# Altium project Oski_Bear_PCB.PrjPcb
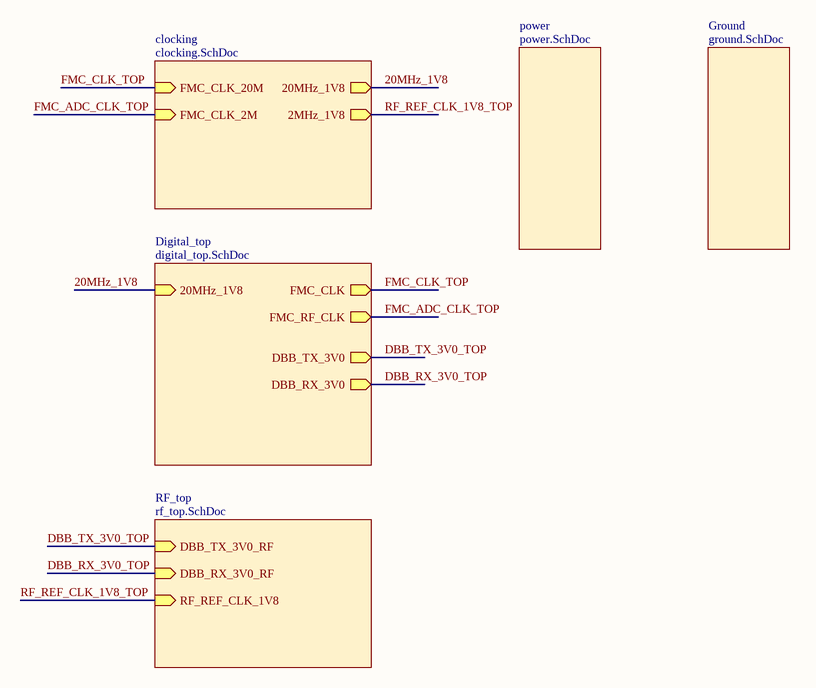
[diagram p0: Top.SchDoc]
6 sheets, 187 parts. Net scope: hierarchical (ports join the sheet entries above them; power ports are global).
Board file: Oski_PCB.PcbDoc
Sheets:
  Top.SchDoc
    Digital_top = digital_top.SchDoc
    power = power.SchDoc
    Ground = ground.SchDoc
    RF_top = rf_top.SchDoc
    clocking = clocking.SchDoc

## Sheet Top.SchDoc
size A; SheetNumber: 1; SheetTotal: 6

### Sub-sheets
clocking = clocking.SchDoc: 20MHz_1V8 (out), FMC_CLK_20M (in), FMC_CLK_2M (in), 2MHz_1V8 (out)
Digital_top = digital_top.SchDoc: 20MHz_1V8 (in), FMC_CLK (out), FMC_RF_CLK (out), DBB_RX_3V0 (out), DBB_TX_3V0 (out)
Ground = ground.SchDoc: no entries
power = power.SchDoc: no entries
RF_top = rf_top.SchDoc: DBB_TX_3V0_RF (in), DBB_RX_3V0_RF (in), RF_REF_CLK_1V8 (in)

### Nets
20MHz_1V8: sheet Digital_top/20MHz_1V8, sheet clocking/20MHz_1V8
DBB_RX_3V0_TOP: sheet Digital_top/DBB_RX_3V0, sheet RF_top/DBB_RX_3V0_RF  [project net DBB_RX_3V0]
DBB_TX_3V0_TOP: sheet Digital_top/DBB_TX_3V0, sheet RF_top/DBB_TX_3V0_RF  [project net DBB_TX_3V0]
FMC_ADC_CLK_TOP: sheet Digital_top/FMC_RF_CLK, sheet clocking/FMC_CLK_2M
FMC_CLK_TOP: sheet Digital_top/FMC_CLK, sheet clocking/FMC_CLK_20M
RF_REF_CLK_1V8_TOP: sheet RF_top/RF_REF_CLK_1V8, sheet clocking/2MHz_1V8  [project net RF_REF_CLK_1V8]

## Sheet digital_top.SchDoc
size 635 x 304 mm; SheetNumber: 4; SheetTotal: 6
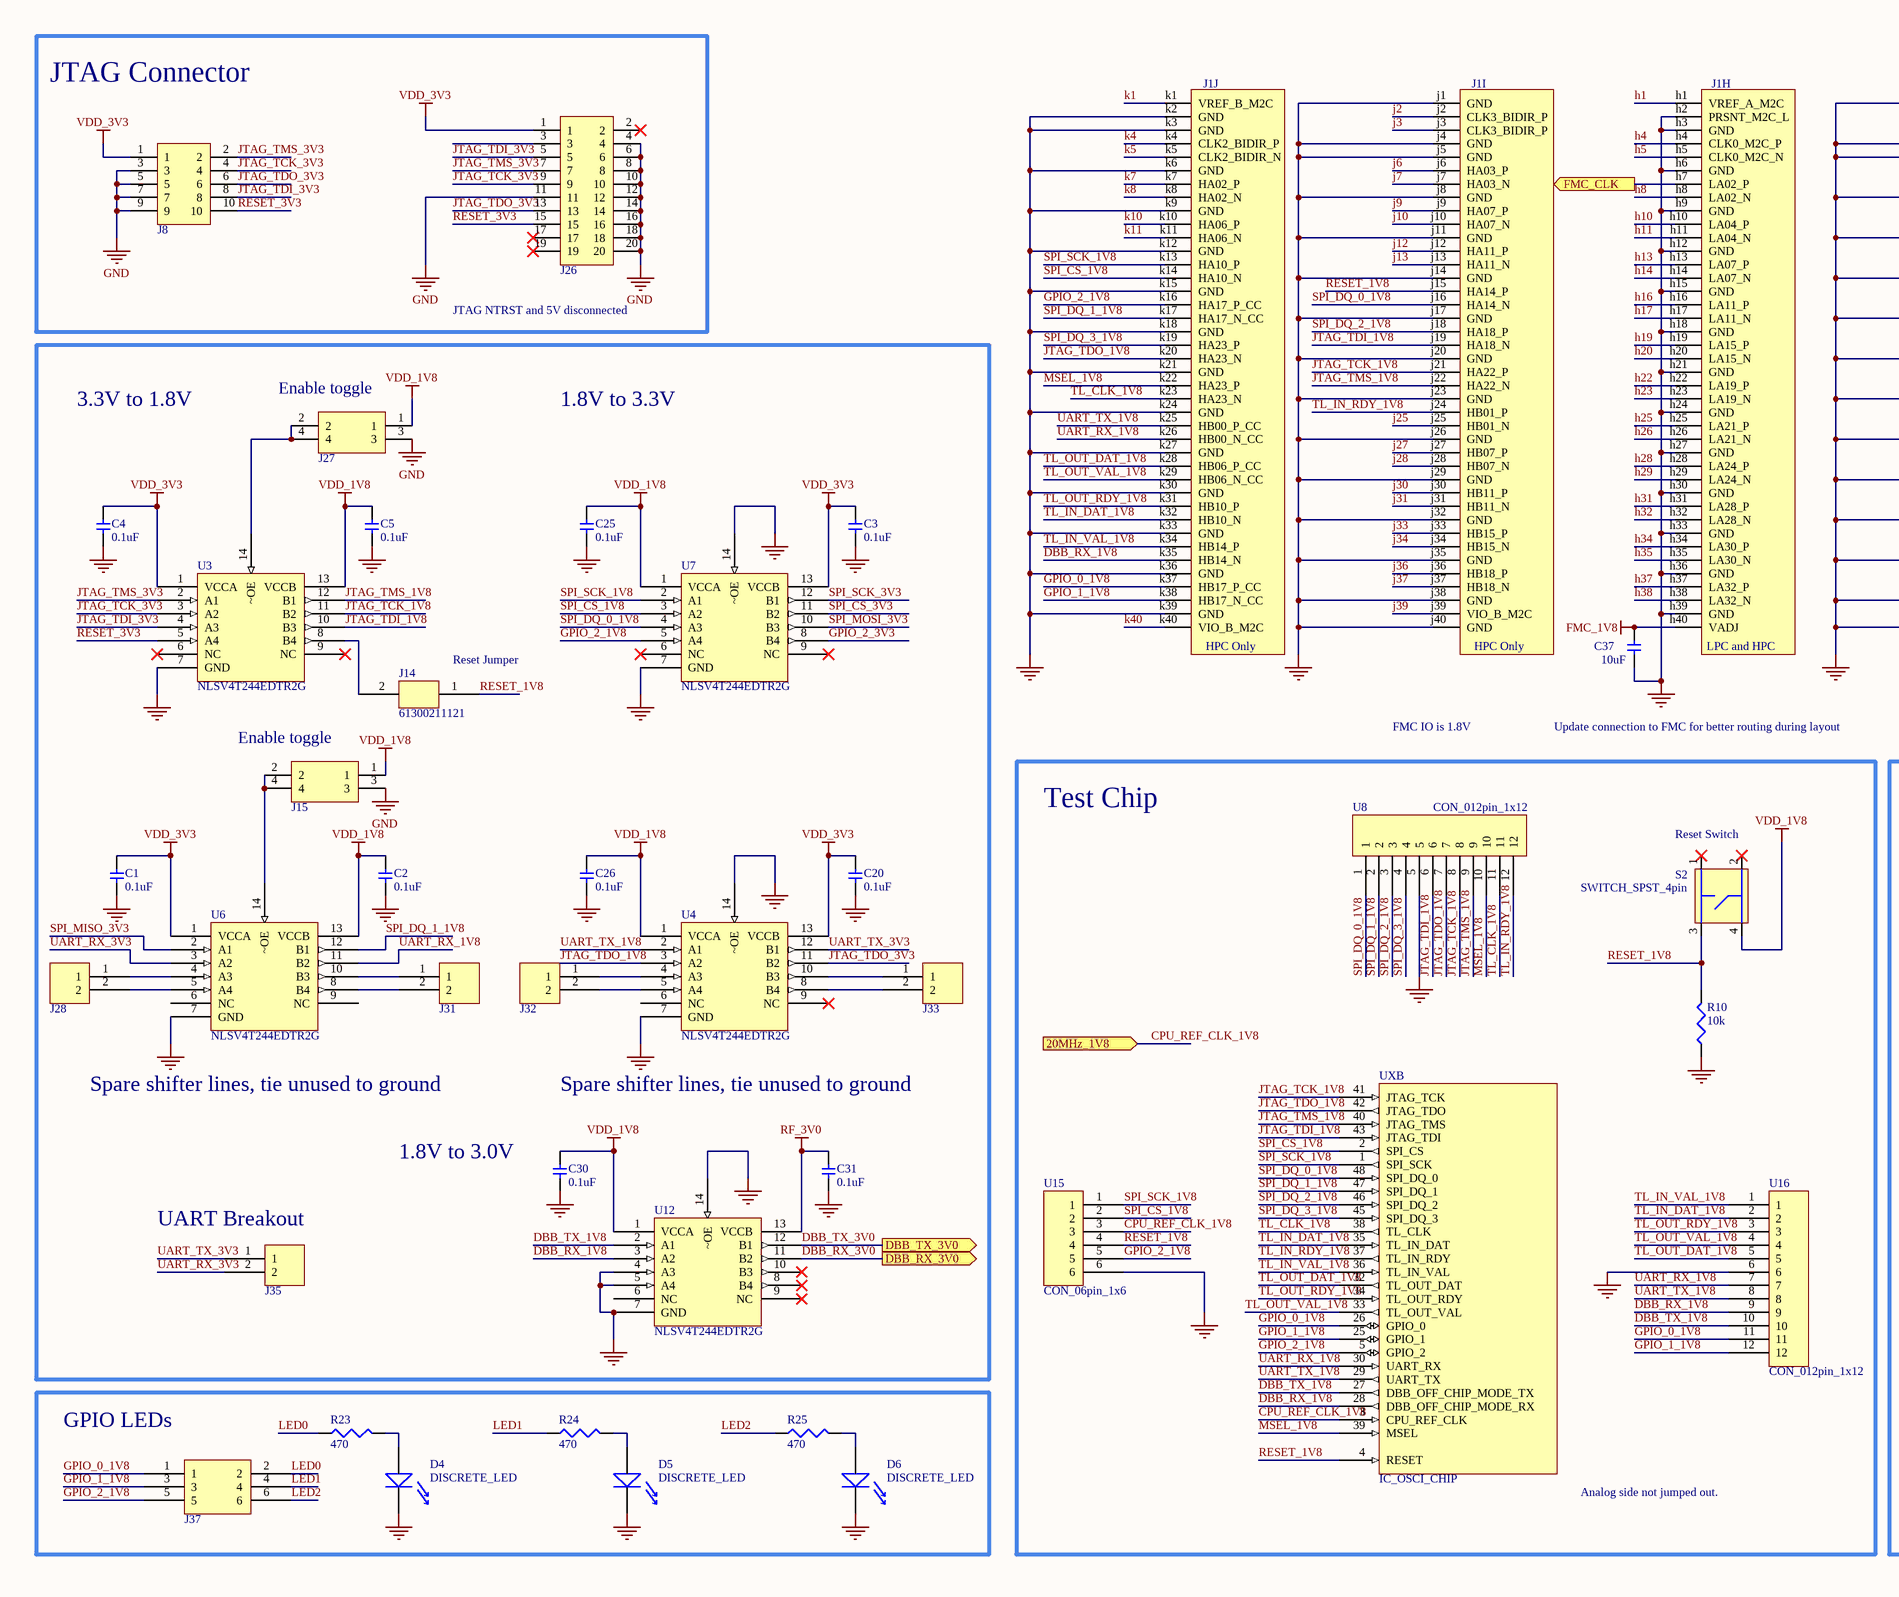
[diagram p1: digital_top.SchDoc, left]
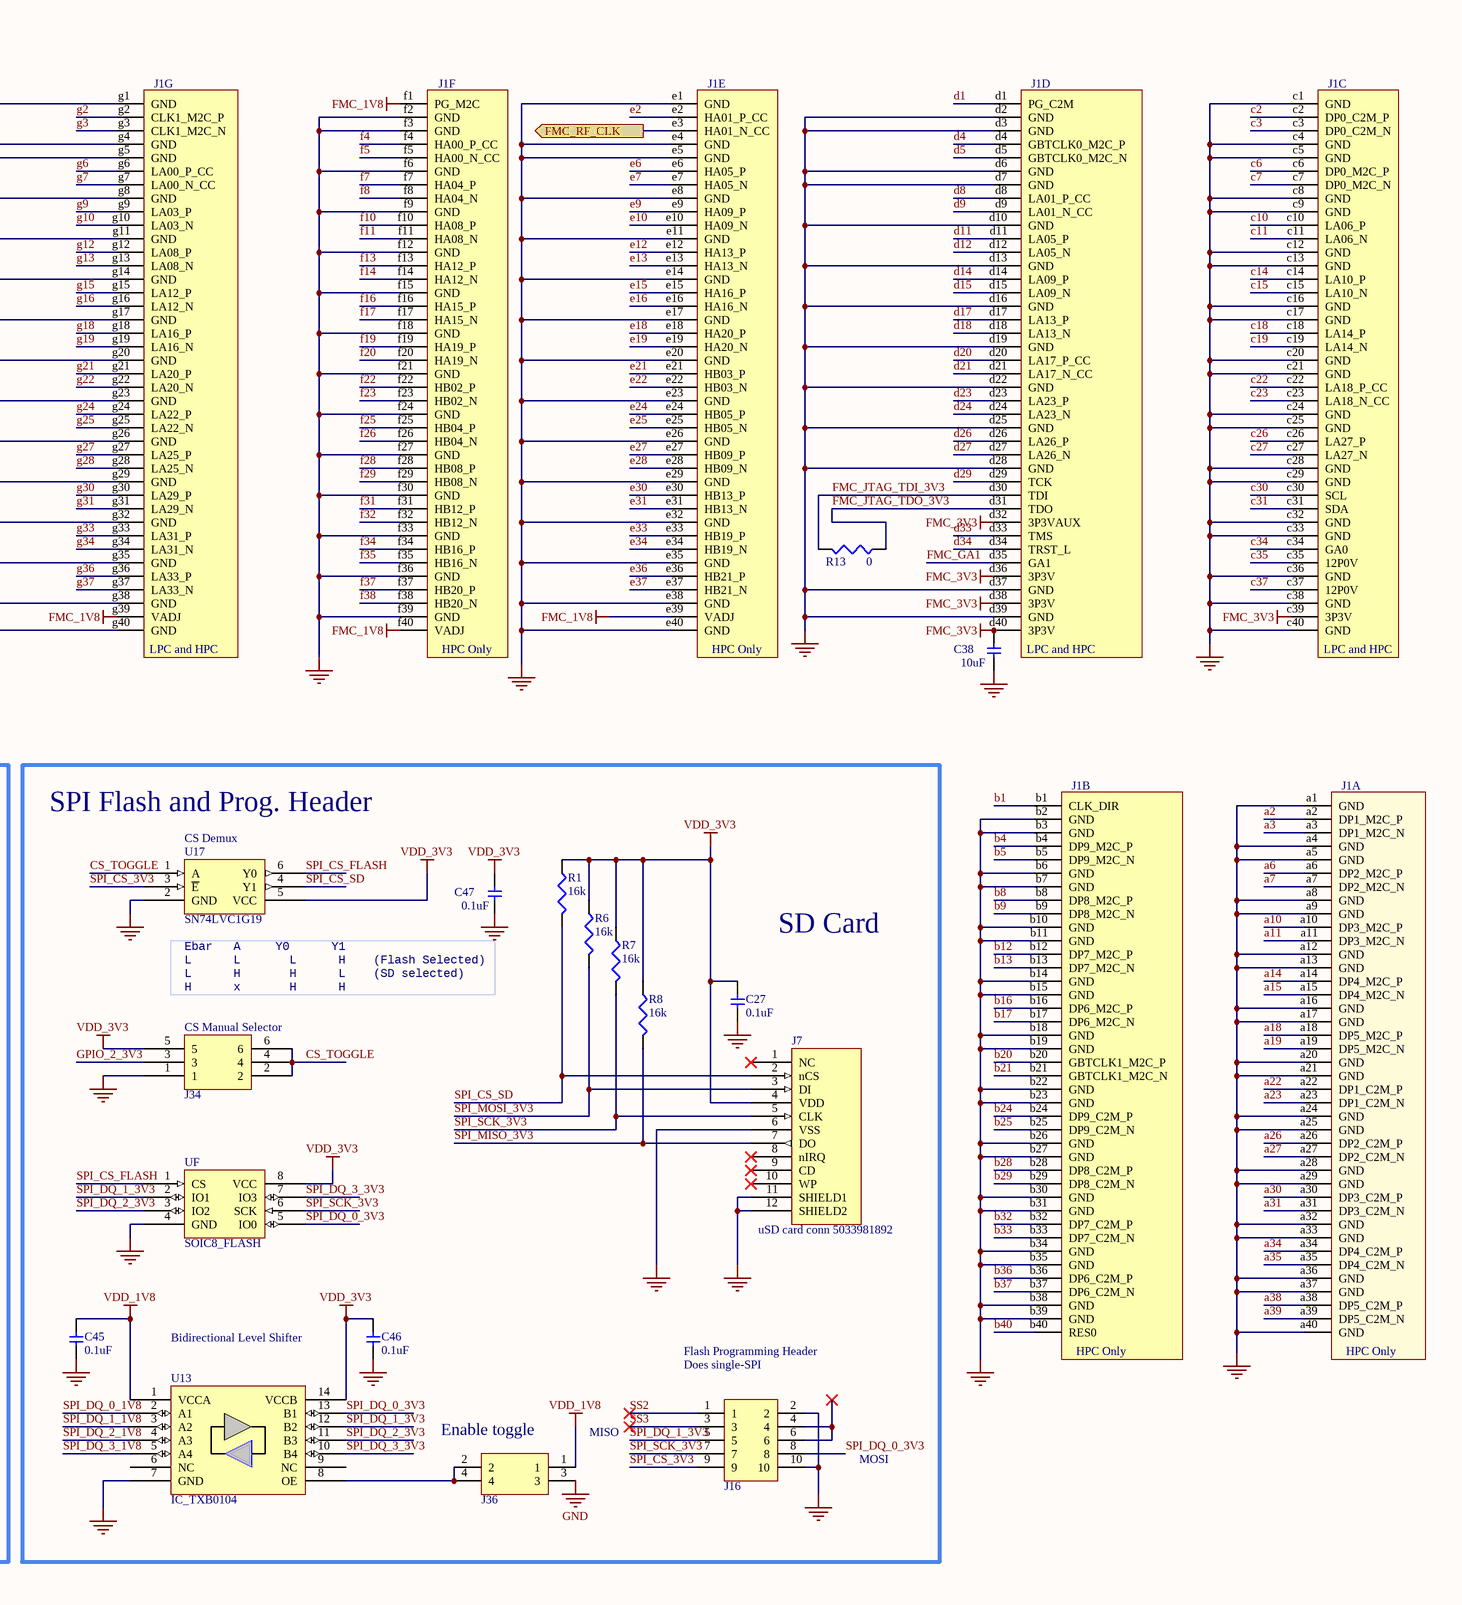
[diagram p2: digital_top.SchDoc, right]

### Parts
C1  0.1uF  [0603]
C2  0.1uF  [0603]
C3  0.1uF  [0603]
C4  0.1uF  [0603]
C5  0.1uF  [0603]
C20  0.1uF  [0603]
C25  0.1uF  [0603]
C26  0.1uF  [0603]
C27  0.1uF  [0603]
C30  0.1uF  [0603]
C31  0.1uF  [0603]
C37  10uF  [0603]
C38  10uF  [0603]
C45  0.1uF  [0603]
C46  0.1uF  [0603]
C47  0.1uF  [0603]
D4  DISCRETE_LED  [LED-1206]
D5  DISCRETE_LED  [LED-1206]
D6  DISCRETE_LED  [LED-1206]
J1  Con 400 pins in 10 parts: abcdefghjk VITA 57  [CON-400-1.27-60.0X14.7/PLUG-SEARAY]  (value not drawn)  (parts A,B,C,D,E,F,G,H,I,J of 10)
J7  uSD card conn 5033981892  [CON-008-1.1-13.1X14.0/MICROSD_MOLEX]
J8  Con 10 pins 2x5  [CON-010-1.27-20.9X7.52/2X5-POST-SH-ST]  (value not drawn)
J14  61300211121  [CON-002-100-200X100/1X2-POST]
J15  Con 4 pins 2x2  [CON-004-100-200X200/2X2-POST]  (value not drawn)
J16  Con 10 pins 2x5  [CON-10-100-500-200/5X2-POST]  (value not drawn)
J26  Con 20 pins 2x10  [CON-020-100-1300X340/SHR-ST]  (value not drawn)
J27  Con 4 pins 2x2  [CON-004-100-200X200/2X2-POST]  (value not drawn)
J28  Con 2 pins  [CON-002-100-200X100/1X2-POST]  (value not drawn)
J31  Con 2 pins  [CON-002-100-200X100/1X2-POST]  (value not drawn)
J32  Con 2 pins  [CON-002-100-200X100/1X2-POST]  (value not drawn)
J33  Con 2 pins  [CON-002-100-200X100/1X2-POST]  (value not drawn)
J34  Con 6 pins 2x3  [CON-006-100-300X200/2X3-POST]  (value not drawn)
J35  Con 2 pins  [CON-002-100-200X100/1X2-POST]  (value not drawn)
J36  Con 4 pins 2x2  [CON-004-100-200X200/2X2-POST]  (value not drawn)
J37  Con 6 pins 2x3  [CON-006-100-300X200/2X3-POST]  (value not drawn)
R1  16k  [0603]
R6  16k  [0603]
R7  16k  [0603]
R8  16k  [0603]
R10  10k  [0603]
R13  0  [0603]
R23  470  [0603]
R24  470  [0603]
R25  470  [0603]
S2  SWITCH_SPST_4pin  [SW-04-4.50-6.0X6.7]
U3  NLSV4T244EDTR2G  [TSSOP-14]
U4  NLSV4T244EDTR2G  [TSSOP-14]
U6  NLSV4T244EDTR2G  [TSSOP-14]
U7  NLSV4T244EDTR2G  [TSSOP-14]
U8  CON_012pin_1x12  [CON-12-100-1200-100/1X12-POST]
U12  NLSV4T244EDTR2G  [TSSOP-14]
U13  IC_TXB0104  [SOIC-14]
U15  CON_06pin_1x6  [CON-6-100-600-100/1X6-POST]
U16  CON_012pin_1x12  [CON-12-100-1200-100/1X12-POST]
U17  SN74LVC1G19  [SOT-23-6]
UF  SOIC8_FLASH  [SOIC-8]
UX  IC_OSCI_CHIP  [QFN-48-.4-6.0X6.0-LP]  (part B of 4)

### Blocks framed on the sheet
JTAG Connector: J8 J26
Test Chip: R10 S2 U8 U15 U16 UX
GPIO LEDs: D4-D6 J37 R23-R25

### Ports
20MHz_1V8 (in), DBB_RX_3V0 (out), DBB_TX_3V0 (out), FMC_CLK (out), FMC_RF_CLK (out)

### Nets
FMC_1V8: C37.1 J1.e39(VADJ) J1.f1(PG_M2C) J1.f40(VADJ) J1.g39(VADJ) J1.h40(VADJ)
FMC_3V3: C38.1 J1.c39(3P3V) J1.d32(3P3VAUX) J1.d36(3P3V) J1.d38(3P3V) J1.d40(3P3V)
GND: C1.2 C2.2 C3.2 C4.2 C5.2 C20.2 C25.2 C26.2 C27.2 C30.2 C31.2 C37.2 C38.2 C45.2 C46.2 C47.2 D4.1 D5.1 D6.1 J1.a1(GND) J1.a4(GND) J1.a5(GND) J1.a8(GND) J1.a9(GND) J1.a12(GND) J1.a13(GND) J1.a16(GND) J1.a17(GND) J1.a20(GND) J1.a21(GND) J1.a24(GND) J1.a25(GND) J1.a28(GND) J1.a29(GND) J1.a32(GND) J1.a33(GND) J1.a36(GND) J1.a37(GND) J1.a40(GND) J1.b2(GND) J1.b3(GND) J1.b6(GND) J1.b7(GND) J1.b10(GND) J1.b11(GND) J1.b14(GND) J1.b15(GND) J1.b18(GND) J1.b19(GND) J1.b22(GND) J1.b23(GND) J1.b26(GND) J1.b27(GND) J1.b30(GND) J1.b31(GND) J1.b34(GND) J1.b35(GND) J1.b38(GND) J1.b39(GND) J1.c1(GND) J1.c4(GND) J1.c5(GND) J1.c8(GND) J1.c9(GND) J1.c12(GND) J1.c13(GND) J1.c16(GND) J1.c17(GND) J1.c20(GND) J1.c21(GND) J1.c24(GND) J1.c25(GND) J1.c28(GND) J1.c29(GND) J1.c32(GND) J1.c33(GND) J1.c36(GND) J1.c38(GND) J1.c40(GND) J1.d2(GND) J1.d3(GND) J1.d6(GND) J1.d7(GND) J1.d10(GND) J1.d13(GND) J1.d16(GND) J1.d19(GND) J1.d22(GND) J1.d25(GND) J1.d28(GND) J1.d37(GND) J1.d39(GND) J1.e1(GND) J1.e4(GND) J1.e5(GND) J1.e8(GND) J1.e11(GND) J1.e14(GND) J1.e17(GND) J1.e20(GND) J1.e23(GND) J1.e26(GND) J1.e29(GND) J1.e32(GND) J1.e35(GND) J1.e38(GND) J1.e40(GND) J1.f2(GND) J1.f3(GND) J1.f6(GND) J1.f9(GND) J1.f12(GND) J1.f15(GND) J1.f18(GND) J1.f21(GND) J1.f24(GND) J1.f27(GND) J1.f30(GND) J1.f33(GND) J1.f36(GND) J1.f39(GND) J1.g1(GND) J1.g4(GND) J1.g5(GND) J1.g8(GND) J1.g11(GND) J1.g14(GND) J1.g17(GND) J1.g20(GND) J1.g23(GND) J1.g26(GND) J1.g29(GND) J1.g32(GND) J1.g35(GND) J1.g38(GND) J1.g40(GND) J1.h2(PRSNT_M2C_L) J1.h3(GND) J1.h6(GND) J1.h9(GND) J1.h12(GND) J1.h15(GND) J1.h18(GND) J1.h21(GND) J1.h24(GND) J1.h27(GND) J1.h30(GND) J1.h33(GND) J1.h36(GND) J1.h39(GND) J1.j1(GND) J1.j4(GND) J1.j5(GND) J1.j8(GND) J1.j11(GND) J1.j14(GND) J1.j17(GND) J1.j20(GND) J1.j23(GND) J1.j26(GND) J1.j29(GND) J1.j32(GND) J1.j35(GND) J1.j38(GND) J1.j40(GND) J1.k2(GND) J1.k3(GND) J1.k6(GND) J1.k9(GND) J1.k12(GND) J1.k15(GND) J1.k18(GND) J1.k21(GND) J1.k24(GND) J1.k27(GND) J1.k30(GND) J1.k33(GND) J1.k36(GND) J1.k39(GND) J7.6(VSS) J7.11(SHIELD1) J7.12(SHIELD2) J8.3 J8.5 J8.7 J8.9 J15.3 J16.2 J16.10 J26.4 J26.6 J26.8 J26.10 J26.11 J26.12 J26.14 J26.16 J26.18 J26.20 J27.3 J34.1 J36.3 R10.1 U3.7(GND) U4.7(GND) U4.14(~OE) U6.7(GND) U7.7(GND) U7.14(~OE) U8.5 U12.4(A3) U12.5(A4) U12.7(GND) U12.14(~OE) U13.7(GND) U15.6 U16.6 U17.2(GND) UF.4(GND)
RF_3V0: C31.1 U12.13(VCCB)
VDD_1V8: C2.1 C5.1 C25.1 C26.1 C30.1 C45.1 J15.1 J27.1 J36.1 S2.4(T) U3.13(VCCB) U4.1(VCCA) U6.13(VCCB) U7.1(VCCA) U12.1(VCCA) U13.1(VCCA)
VDD_3V3: C1.1 C3.1 C4.1 C20.1 C27.1 C46.1 C47.1 J7.4(VDD) J8.1 J26.1 J34.5 R1.1 R6.1 R7.1 R8.1 U3.1(VCCA) U4.13(VCCB) U6.1(VCCA) U7.13(VCCB) U13.14(VCCB) U17.5(VCC) UF.8(VCC)
a2: J1.a2(DP1_M2C_P)
a3: J1.a3(DP1_M2C_N)
a6: J1.a6(DP2_M2C_P)
a7: J1.a7(DP2_M2C_N)
a10: J1.a10(DP3_M2C_P)
a11: J1.a11(DP3_M2C_N)
a14: J1.a14(DP4_M2C_P)
a15: J1.a15(DP4_M2C_N)
a18: J1.a18(DP5_M2C_P)
a19: J1.a19(DP5_M2C_N)
a22: J1.a22(DP1_C2M_P)
a23: J1.a23(DP1_C2M_N)
a26: J1.a26(DP2_C2M_P)
a27: J1.a27(DP2_C2M_N)
a30: J1.a30(DP3_C2M_P)
a31: J1.a31(DP3_C2M_N)
a34: J1.a34(DP4_C2M_P)
a35: J1.a35(DP4_C2M_N)
a38: J1.a38(DP5_C2M_P)
a39: J1.a39(DP5_C2M_N)
b1: J1.b1(CLK_DIR)
b4: J1.b4(DP9_M2C_P)
b5: J1.b5(DP9_M2C_N)
b8: J1.b8(DP8_M2C_P)
b9: J1.b9(DP8_M2C_N)
b12: J1.b12(DP7_M2C_P)
b13: J1.b13(DP7_M2C_N)
b16: J1.b16(DP6_M2C_P)
b17: J1.b17(DP6_M2C_N)
b20: J1.b20(GBTCLK1_M2C_P)
b21: J1.b21(GBTCLK1_M2C_N)
b24: J1.b24(DP9_C2M_P)
b25: J1.b25(DP9_C2M_N)
b28: J1.b28(DP8_C2M_P)
b29: J1.b29(DP8_C2M_N)
b32: J1.b32(DP7_C2M_P)
b33: J1.b33(DP7_C2M_N)
b36: J1.b36(DP6_C2M_P)
b37: J1.b37(DP6_C2M_N)
b40: J1.b40(RES0)
c2: J1.c2(DP0_C2M_P)
c3: J1.c3(DP0_C2M_N)
c6: J1.c6(DP0_M2C_P)
c7: J1.c7(DP0_M2C_N)
c10: J1.c10(LA06_P)
c11: J1.c11(LA06_N)
c14: J1.c14(LA10_P)
c15: J1.c15(LA10_N)
c18: J1.c18(LA14_P)
c19: J1.c19(LA14_N)
c22: J1.c22(LA18_P_CC)
c23: J1.c23(LA18_N_CC)
c26: J1.c26(LA27_P)
c27: J1.c27(LA27_N)
c30: J1.c30(SCL)
c31: J1.c31(SDA)
c34: J1.c34(GA0)
c35: J1.c35(12P0V)
c37: J1.c37(12P0V)
CPU_REF_CLK_1V8: U15.3 UX.3(CPU_REF_CLK) ; port 20MHz_1V8  [project net 20MHz_1V8]
CS_TOGGLE: J34.2 J34.4 J34.6 U17.1(A)
d1: J1.d1(PG_C2M)
d4: J1.d4(GBTCLK0_M2C_P)
d5: J1.d5(GBTCLK0_M2C_N)
d8: J1.d8(LA01_P_CC)
d9: J1.d9(LA01_N_CC)
d11: J1.d11(LA05_P)
d12: J1.d12(LA05_N)
d14: J1.d14(LA09_P)
d15: J1.d15(LA09_N)
d17: J1.d17(LA13_P)
d18: J1.d18(LA13_N)
d20: J1.d20(LA17_P_CC)
d21: J1.d21(LA17_N_CC)
d23: J1.d23(LA23_P)
d24: J1.d24(LA23_N)
d26: J1.d26(LA26_P)
d27: J1.d27(LA26_N)
d29: J1.d29(TCK)
d33: J1.d33(TMS)
d34: J1.d34(TRST_L)
DBB_RX_1V8: J1.k35(HB14_N) U12.3(A2) U16.9 UX.28(DBB_OFF_CHIP_MODE_RX)
DBB_RX_3V0: U12.11(B2) ; port DBB_RX_3V0
DBB_TX_1V8: U12.2(A1) U16.10 UX.27(DBB_OFF_CHIP_MODE_TX)
DBB_TX_3V0: U12.12(B1) ; port DBB_TX_3V0
e2: J1.e2(HA01_P_CC)
e6: J1.e6(HA05_P)
e7: J1.e7(HA05_N)
e9: J1.e9(HA09_P)
e10: J1.e10(HA09_N)
e12: J1.e12(HA13_P)
e13: J1.e13(HA13_N)
e15: J1.e15(HA16_P)
e16: J1.e16(HA16_N)
e18: J1.e18(HA20_P)
e19: J1.e19(HA20_N)
e21: J1.e21(HB03_P)
e22: J1.e22(HB03_N)
e24: J1.e24(HB05_P)
e25: J1.e25(HB05_N)
e27: J1.e27(HB09_P)
e28: J1.e28(HB09_N)
e30: J1.e30(HB13_P)
e31: J1.e31(HB13_N)
e33: J1.e33(HB19_P)
e34: J1.e34(HB19_N)
e36: J1.e36(HB21_P)
e37: J1.e37(HB21_N)
f4: J1.f4(HA00_P_CC)
f5: J1.f5(HA00_N_CC)
f7: J1.f7(HA04_P)
f8: J1.f8(HA04_N)
f10: J1.f10(HA08_P)
f11: J1.f11(HA08_N)
f13: J1.f13(HA12_P)
f14: J1.f14(HA12_N)
f16: J1.f16(HA15_P)
f17: J1.f17(HA15_N)
f19: J1.f19(HA19_P)
f20: J1.f20(HA19_N)
f22: J1.f22(HB02_P)
f23: J1.f23(HB02_N)
f25: J1.f25(HB04_P)
f26: J1.f26(HB04_N)
f28: J1.f28(HB08_P)
f29: J1.f29(HB08_N)
f31: J1.f31(HB12_P)
f32: J1.f32(HB12_N)
f34: J1.f34(HB16_P)
f35: J1.f35(HB16_N)
f37: J1.f37(HB20_P)
f38: J1.f38(HB20_N)
FMC_ADC_CLK_TOP: J1.e3(HA01_N_CC) ; port FMC_RF_CLK
FMC_CLK_TOP: J1.h7(LA02_P) ; port FMC_CLK
FMC_GA1: J1.d35(GA1)
FMC_JTAG_TDI_3V3: J1.d30(TDI) R13.2
FMC_JTAG_TDO_3V3: J1.d31(TDO) R13.1
g2: J1.g2(CLK1_M2C_P)
g3: J1.g3(CLK1_M2C_N)
g6: J1.g6(LA00_P_CC)
g7: J1.g7(LA00_N_CC)
g9: J1.g9(LA03_P)
g10: J1.g10(LA03_N)
g12: J1.g12(LA08_P)
g13: J1.g13(LA08_N)
g15: J1.g15(LA12_P)
g16: J1.g16(LA12_N)
g18: J1.g18(LA16_P)
g19: J1.g19(LA16_N)
g21: J1.g21(LA20_P)
g22: J1.g22(LA20_N)
g24: J1.g24(LA22_P)
g25: J1.g25(LA22_N)
g27: J1.g27(LA25_P)
g28: J1.g28(LA25_N)
g30: J1.g30(LA29_P)
g31: J1.g31(LA29_N)
g33: J1.g33(LA31_P)
g34: J1.g34(LA31_N)
g36: J1.g36(LA33_P)
g37: J1.g37(LA33_N)
GPIO_0_1V8: J1.k37(HB17_P_CC) J37.1 U16.11 UX.26(GPIO_0)
GPIO_1_1V8: J1.k38(HB17_N_CC) J37.3 U16.12 UX.25(GPIO_1)
GPIO_2_1V8: J1.k16(HA17_P_CC) J37.5 U7.5(A4) U15.5 UX.5(GPIO_2)
GPIO_2_3V3: J34.3 U7.8(B4)
h1: J1.h1(VREF_A_M2C)
h4: J1.h4(CLK0_M2C_P)
h5: J1.h5(CLK0_M2C_N)
h8: J1.h8(LA02_N)
h10: J1.h10(LA04_P)
h11: J1.h11(LA04_N)
h13: J1.h13(LA07_P)
h14: J1.h14(LA07_N)
h16: J1.h16(LA11_P)
h17: J1.h17(LA11_N)
h19: J1.h19(LA15_P)
h20: J1.h20(LA15_N)
h22: J1.h22(LA19_P)
h23: J1.h23(LA19_N)
h25: J1.h25(LA21_P)
h26: J1.h26(LA21_N)
h28: J1.h28(LA24_P)
h29: J1.h29(LA24_N)
h31: J1.h31(LA28_P)
h32: J1.h32(LA28_N)
h34: J1.h34(LA30_P)
h35: J1.h35(LA30_N)
h37: J1.h37(LA32_P)
h38: J1.h38(LA32_N)
j2: J1.j2(CLK3_BIDIR_P)
j3: J1.j3(CLK3_BIDIR_P)
j6: J1.j6(HA03_P)
j7: J1.j7(HA03_N)
j9: J1.j9(HA07_P)
j10: J1.j10(HA07_N)
j12: J1.j12(HA11_P)
j13: J1.j13(HA11_N)
j25: J1.j25(HB01_N)
j27: J1.j27(HB07_P)
j28: J1.j28(HB07_N)
j30: J1.j30(HB11_P)
j31: J1.j31(HB11_N)
j33: J1.j33(HB15_P)
j34: J1.j34(HB15_N)
j36: J1.j36(HB18_P)
j37: J1.j37(HB18_N)
j39: J1.j39(VIO_B_M2C)
JTAG_TCK_1V8: J1.j21(HA22_P) U3.11(B2) U8.8 UX.41(JTAG_TCK)
JTAG_TCK_3V3: J8.4 J26.9 U3.3(A2)
JTAG_TDI_1V8: J1.j19(HA18_N) U3.10(B3) U8.6 UX.43(JTAG_TDI)
JTAG_TDI_3V3: J8.8 J26.5 U3.4(A3)
JTAG_TDO_1V8: J1.k20(HA23_N) U4.3(A2) U8.7 UX.42(JTAG_TDO)
JTAG_TDO_3V3: J8.6 J26.13 U4.11(B2)
JTAG_TMS_1V8: J1.j22(HA22_N) U3.12(B1) U8.9 UX.40(JTAG_TMS)
JTAG_TMS_3V3: J8.2 J26.7 U3.2(A1)
k1: J1.k1(VREF_B_M2C)
k4: J1.k4(CLK2_BIDIR_P)
k5: J1.k5(CLK2_BIDIR_N)
k7: J1.k7(HA02_P)
k8: J1.k8(HA02_N)
k10: J1.k10(HA06_P)
k11: J1.k11(HA06_N)
k40: J1.k40(VIO_B_M2C)
LED0: J37.2 R23.1
LED1: J37.4 R24.1
LED2: J37.6 R25.1
MSEL_1V8: J1.k22(HA23_P) U8.10 UX.39(MSEL)
RESET_1V8: J1.j15(HA14_P) J14.1 R10.2 S2.3(T) U15.4 UX.4(RESET)
RESET_3V3: J8.10 J26.15 U3.5(A4)
SPI_CS_1V8: J1.k14(HA10_N) U7.3(A2) U15.2 UX.2(SPI_CS)
SPI_CS_3V3: J16.9 U7.11(B2) U17.3(~{E})
SPI_CS_FLASH: U17.6(Y0) UF.1(CS)
SPI_CS_SD: J7.2(nCS) R1.2 U17.4(Y1)
SPI_DQ_0_1V8: J1.j16(HA14_N) U7.4(A3) U8.1 U13.2(A1) UX.48(SPI_DQ_0)
SPI_DQ_0_3V3: J16.8 U13.13(B1) UF.5(IO0)
SPI_DQ_1_1V8: J1.k17(HA17_N_CC) U6.12(B1) U8.2 U13.3(A2) UX.47(SPI_DQ_1)
SPI_DQ_1_3V3: J16.5 U13.12(B2) UF.2(IO1)
SPI_DQ_2_1V8: J1.j18(HA18_P) U8.3 U13.4(A3) UX.46(SPI_DQ_2)
SPI_DQ_2_3V3: U13.11(B3) UF.3(IO2)
SPI_DQ_3_1V8: J1.k19(HA23_P) U8.4 U13.5(A4) UX.45(SPI_DQ_3)
SPI_DQ_3_3V3: U13.10(B4) UF.7(IO3)
SPI_MISO_3V3: J7.7(DO) R8.2 U6.2(A1)
SPI_MOSI_3V3: J7.3(DI) R6.2 U7.10(B3)
SPI_SCK_1V8: J1.k13(HA10_P) U7.2(A1) U15.1 UX.1(SPI_SCK)
SPI_SCK_3V3: J7.5(CLK) J16.7 R7.2 U7.12(B1) UF.6(SCK)
SS2: J16.1
SS3: J16.3
TL_CLK_1V8: J1.k23(HA23_N) U8.11 UX.38(TL_CLK)
TL_IN_DAT_1V8: J1.k32(HB10_N) U16.2 UX.35(TL_IN_DAT)
TL_IN_RDY_1V8: J1.j24(HB01_P) U8.12 UX.37(TL_IN_RDY)
TL_IN_VAL_1V8: J1.k34(HB14_P) U16.1 UX.36(TL_IN_VAL)
TL_OUT_DAT_1V8: J1.k28(HB06_P_CC) U16.5 UX.32(TL_OUT_DAT)
TL_OUT_RDY_1V8: J1.k31(HB10_P) U16.3 UX.34(TL_OUT_RDY)
TL_OUT_VAL_1V8: J1.k29(HB06_N_CC) U16.4 UX.33(TL_OUT_VAL)
UART_RX_1V8: J1.k26(HB00_N_CC) U6.11(B2) U16.7 UX.30(UART_RX)
UART_RX_3V3: J35.2 U6.3(A2)
UART_TX_1V8: J1.k25(HB00_P_CC) U4.2(A1) U16.8 UX.29(UART_TX)
UART_TX_3V3: J35.1 U4.12(B1)
NetD4_2: D4.2 R23.2
NetD5_2: D5.2 R24.2
NetD6_2: D6.2 R25.2
NetJ14_2: J14.2 U3.8(B4)
NetJ15_2: J15.2 J15.4 U6.14(~OE)
NetJ16_4: J16.4 J16.6
NetJ27_2: J27.2 J27.4 U3.14(~OE)
NetJ28_1: J28.1 U6.4(A3)
NetJ28_2: J28.2 U6.5(A4)
NetJ31_1: J31.1 U6.10(B3)
NetJ31_2: J31.2 U6.8(B4)
NetJ32_1: J32.1 U4.4(A3)
NetJ32_2: J32.2 U4.5(A4)
NetJ33_1: J33.1 U4.10(B3)
NetJ33_2: J33.2 U4.8(B4)
NetJ36_2: J36.2 J36.4 U13.8(OE)

Not connected (* = marked no-connect by the designer): J7 1(NC)* 8(nIRQ)* 9(CD)* 10(WP)*; J26 2* 3 17* 19*; S2 1(T)* 2(P)*; U3 6(NC)* 9(NC)*; U4 6(NC) 9(NC)*; U6 6(NC) 9(NC); U7 6(NC)* 9(NC)*; U12 6(NC) 8(B4)* 9(NC)* 10(B3)*; U13 6(NC) 9(NC)

### Notes on the sheet
- JTAG NTRST and 5V disconnected
- 3.3V to 1.8V
- (near J27) Enable toggle
- 1.8V to 3.3V
- (near J14) Reset Jumper
- (near J15) Enable toggle
- FMC IO is 1.8V
- Update connection to FMC for better routing during layout
- SPI Flash and Prog. Header
- (near S2) Reset Switch
- (near U17) CS Demux
- L      L       L      H    (Flash Selected)
- (near U17) Ebar   A     Y0      Y1
- SD Card
- L      H       H      L    (SD selected)
- H      x       H      H
- (near J34) CS Manual Selector
- Spare shifter lines, tie unused to ground
- (near C30) 1.8V to 3.0V
- (near J35) UART Breakout
- Bidirectional Level Shifter
- Flash Programming Header
- (near J16) Does single-SPI
- (near J36) Enable toggle
- (near J36) MISO
- Analog side not jumped out.
- MOSI
- (in symbol CON_400pin_10x40_VITA57_PLUG, part A) HPC Only
- (in symbol CON_400pin_10x40_VITA57_PLUG, part B) HPC Only
- (in symbol CON_400pin_10x40_VITA57_PLUG, part C) LPC and HPC
- (in symbol CON_400pin_10x40_VITA57_PLUG, part D) LPC and HPC
- (in symbol CON_400pin_10x40_VITA57_PLUG, part E) HPC Only
- (in symbol CON_400pin_10x40_VITA57_PLUG, part F) HPC Only
- (in symbol CON_400pin_10x40_VITA57_PLUG, part G) LPC and HPC
- (in symbol CON_400pin_10x40_VITA57_PLUG, part H) LPC and HPC
- (in symbol CON_400pin_10x40_VITA57_PLUG, part I) HPC Only
- (in symbol CON_400pin_10x40_VITA57_PLUG, part J) HPC Only

### Library data of the parts
C1-C5 C20 C25-C27 C30 C31 C45 C46 = DISCRETE_C: 0.1uF 0402
C37 C38 C47 = DISCRETE_C: 10uF 0603
D4-D6 = DISCRETE_LED: LED generic
J1 = CON_400pin_10x40_VITA57_PLUG: Con VITA 57, 400 male contacts in 10 parts abcdefghjk; Author: CERN DEM JLC
J7 = CON_010pin_uSD_CARD_RECP: Con 8 pins secure digital card slot (micro)
J8 J16 = CON_010pin_2x5
J15 J27 J36 = CON_004pin_2x2
J26 = CON_020pin_2x10
J28 J31-J33 J35 = CON_002pin_1x2
J34 J37 = CON_006pin_2x3
R1 R6-R8 R10 = DISCRETE_R
R13 = DISCRETE_R: 0 0603
R23-R25 = DISCRETE_R: 200 0402
S2 = SWITCH_SPST_4pin: Switch 4 pins
U3 U4 U6 U7 U12 = NLSV4T244EDTR2G: Non-Inverting Level / Translator, Dual-Supply, / 4-Bit
U13 = IC_TXB0104: 4-Bit Bidirectional Voltage-level Translator With Automatic Direction / Sensing
U17 = SN74LVC1G19: 1-of-2 Decoder and Demultiplexer
UX = IC_OSCI_CHIP: EE290C Tapeout Class IC

## Sheet power.SchDoc
size 508 x 241 mm; SheetNumber: 2; SheetTotal: 6
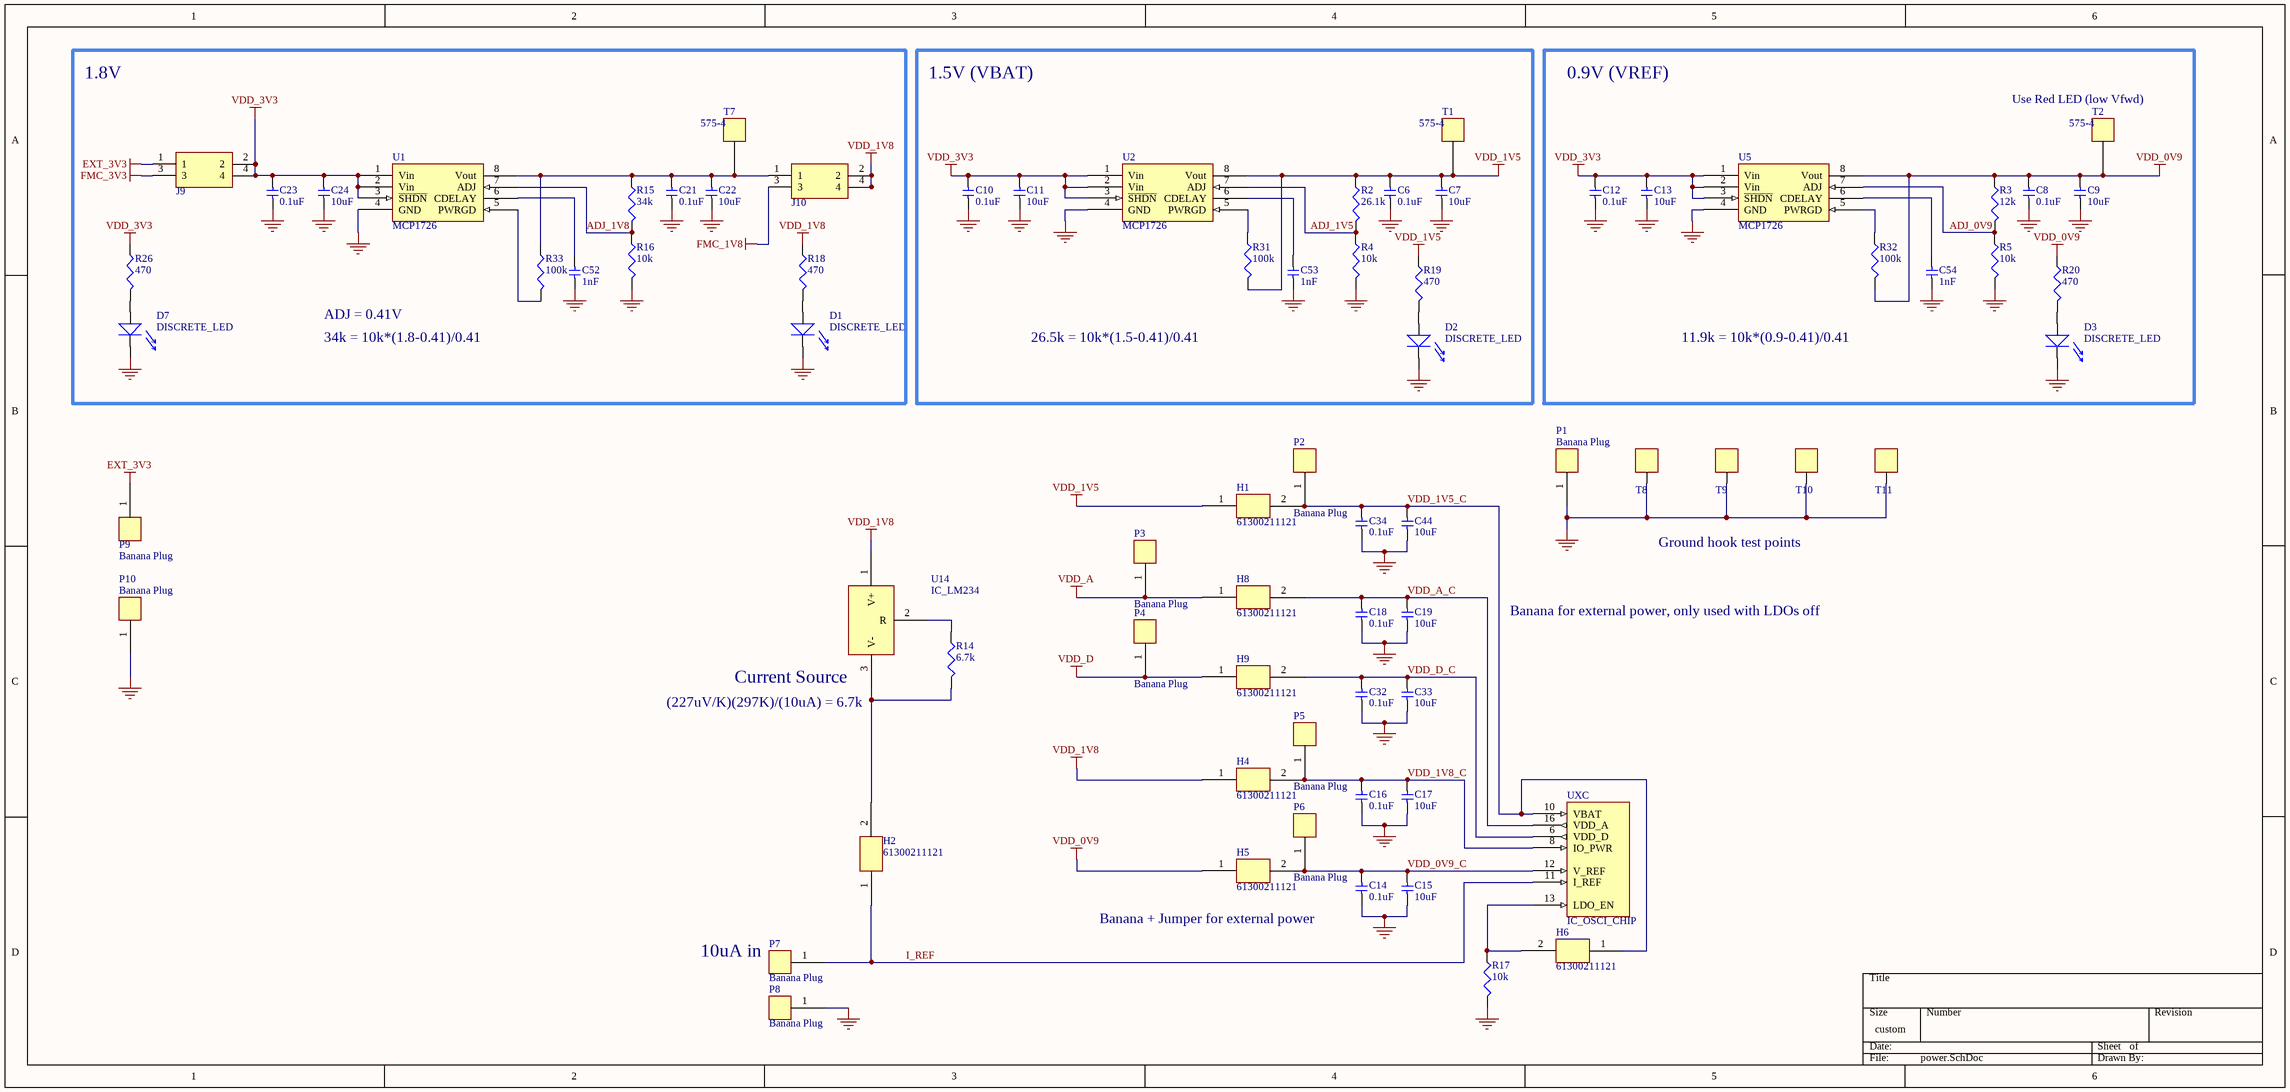
[diagram p3: power.SchDoc]

### Parts
C6  0.1uF  [0603]
C7  10uF  [0603]
C8  0.1uF  [0603]
C9  10uF  [0603]
C10  0.1uF  [0603]
C11  10uF  [0603]
C12  0.1uF  [0603]
C13  10uF  [0603]
C14  0.1uF  [0603]
C15  10uF  [0603]
C16  0.1uF  [0603]
C17  10uF  [0603]
C18  0.1uF  [0603]
C19  10uF  [0603]
C21  0.1uF  [0603]
C22  10uF  [0603]
C23  0.1uF  [0603]
C24  10uF  [0603]
C32  0.1uF  [0603]
C33  10uF  [0603]
C34  0.1uF  [0603]
C44  10uF  [0603]
C52  1nF  [0603]
C53  1nF  [0603]
C54  1nF  [0603]
D1  DISCRETE_LED  [LED-1206]
D2  DISCRETE_LED  [LED-1206]
D3  DISCRETE_LED  [LED-1206]
D7  DISCRETE_LED  [LED-1206]
H1  61300211121  [CON-002-100-200X100/1X2-POST]
H2  61300211121  [CON-002-100-200X100/1X2-POST]
H4  61300211121  [CON-002-100-200X100/1X2-POST]
H5  61300211121  [CON-002-100-200X100/1X2-POST]
H6  61300211121  [CON-002-100-200X100/1X2-POST]
H8  61300211121  [CON-002-100-200X100/1X2-POST]
H9  61300211121  [CON-002-100-200X100/1X2-POST]
J9  Con 4 pins 2x2  [CON-004-100-200X200/2X2-POST]  (value not drawn)
J10  Con 4 pins 2x2  [CON-004-100-200X200/2X2-POST]  (value not drawn)
P1  Banana Plug  [CON-001-312X312/BANANA-JACK]
P2  Banana Plug  [CON-001-312X312/BANANA-JACK]
P3  Banana Plug  [CON-001-312X312/BANANA-JACK]
P4  Banana Plug  [CON-001-312X312/BANANA-JACK]
P5  Banana Plug  [CON-001-312X312/BANANA-JACK]
P6  Banana Plug  [CON-001-312X312/BANANA-JACK]
P7  Banana Plug  [CON-001-312X312/BANANA-JACK]
P8  Banana Plug  [CON-001-312X312/BANANA-JACK]
P9  Banana Plug  [CON-001-312X312/BANANA-JACK]
P10  Banana Plug  [CON-001-312X312/BANANA-JACK]
R2  26.1k  [0603]
R3  12k  [0603]
R4  10k  [0603]
R5  10k  [0603]
R14  6.7k  [0603]
R15  34k  [0603]
R16  10k  [0603]
R17  10k  [0603]
R18  470  [0603]
R19  470  [0603]
R20  470  [0603]
R26  470  [0603]
R31  100k  [0603]
R32  100k  [0603]
R33  100k  [0603]
T1  575-4  [TP-100X100/ROUND-THT]
T2  575-4  [TP-100X100/ROUND-THT]
T7  575-4  [TP-100X100/ROUND-THT]
T8  Test point 1 pin  [TP-100X100/ROUND-THT]  (value not drawn)
T9  Test point 1 pin  [TP-100X100/ROUND-THT]  (value not drawn)
T10  Test point 1 pin  [TP-100X100/ROUND-THT]  (value not drawn)
T11  Test point 1 pin  [TP-100X100/ROUND-THT]  (value not drawn)
U1  MCP1726  [SOIC-8]
U2  MCP1726  [SOIC-8]
U5  MCP1726  [SOIC-8]
U14  IC_LM234  [TO-92]
UX  IC_OSCI_CHIP  [QFN-48-.4-6.0X6.0-LP]  (part C of 4)

### Blocks framed on the sheet
1.8V: C21-C24 C52 D1 D7 J9 J10 R15 R16 R18 R26 R33 T7 U1
1.5V (VBAT): C6 C7 C10 C11 C53 D2 R2 R4 R19 R31 T1 U2
0.9V (VREF): C8 C9 C12 C13 C54 D3 R3 R5 R20 R32 T2 U5

### Nets
EXT_3V3: J9.1 P9.1
FMC_1V8: J10.3
FMC_3V3: J9.3
GND: C6.2 C7.2 C8.2 C9.2 C10.2 C11.2 C12.2 C13.2 C14.2 C15.2 C16.2 C17.2 C18.2 C19.2 C21.2 C22.2 C23.2 C24.2 C32.2 C33.2 C34.2 C44.2 C52.2 C53.2 C54.2 D1.1 D2.1 D3.1 D7.1 P1.1 P8.1 P10.1 R4.2 R5.2 R16.2 R17.2 T8.1 T9.1 T10.1 T11.1 U1.4(GND) U2.4(GND) U5.4(GND)
VDD_0V9: C8.1 C9.1 H5.1 R3.1 R20.1 R32.2 T2.1 U5.8(Vout)
VDD_1V5: C6.1 C7.1 H1.1 R2.1 R19.1 R31.2 T1.1 U2.8(Vout)
VDD_1V8: H4.1 J10.2 J10.4 R18.1 U14.1(V+)
VDD_3V3: C10.1 C11.1 C12.1 C13.1 C23.1 C24.1 J9.2 J9.4 R26.1 U1.1(Vin) U1.2(Vin) U1.3(~{SHDN}) U2.1(Vin) U2.2(Vin) U2.3(~{SHDN}) U5.1(Vin) U5.2(Vin) U5.3(~{SHDN})
VDD_A: H8.1 P3.1
VDD_D: H9.1 P4.1
ADJ_0V9: R3.2 R5.1 U5.7(ADJ)
ADJ_1V5: R2.2 R4.1 U2.7(ADJ)
ADJ_1V8: R15.2 R16.1 U1.7(ADJ)
I_REF: H2.1 P7.1 UX.11(I_REF)
VDD_0V9_C: C14.1 C15.1 H5.2 P6.1 UX.12(V_REF)
VDD_1V5_C: C34.1 C44.1 H1.2 H6.1 P2.1 UX.10(VBAT)
VDD_1V8_C: C16.1 C17.1 H4.2 P5.1 UX.8(IO_PWR)
VDD_A_C: C18.1 C19.1 H8.2 UX.16(VDD_A)
VDD_D_C: C32.1 C33.1 H9.2 UX.6(VDD_D)
NetC21_1: C21.1 C22.1 J10.1 R15.1 R33.1 T7.1 U1.8(Vout)
NetC52_1: C52.1 U1.6(CDELAY)
NetC53_1: C53.1 U2.6(CDELAY)
NetC54_1: C54.1 U5.6(CDELAY)
NetD1_2: D1.2 R18.2
NetD2_2: D2.2 R19.2
NetD3_2: D3.2 R20.2
NetD7_2: D7.2 R26.2
NetH2_2: H2.2 R14.2 U14.3(V-)
NetH6_2: H6.2 R17.1 UX.13(LDO_EN)
NetR14_1: R14.1 U14.2(R)
NetR31_1: R31.1 U2.5(PWRGD)
NetR32_1: R32.1 U5.5(PWRGD)
NetR33_2: R33.2 U1.5(PWRGD)

### Notes on the sheet
- (near T2) Use Red LED (low Vfwd)
- ADJ = 0.41V
- 34k = 10k*(1.8-0.41)/0.41
- 26.5k = 10k*(1.5-0.41)/0.41
- 11.9k = 10k*(0.9-0.41)/0.41
- Ground hook test points
- Banana for external power, only used with LDOs off
- (near U14) (227uV/K)(297K)/(10uA) = 6.7k
- (near U14) Current Source
- Banana + Jumper for external power
- (near P7) 10uA in

### Library data of the parts
C6 C8 C10 C12 C14 C16 C18 C21 C23 C32 C34 C52-C54 = DISCRETE_C: 0.1uF 0402
C7 C9 C11 C13 C15 C17 C19 C22 C24 C33 C44 = DISCRETE_C: 10uF 0603
D1-D3 D7 = DISCRETE_LED: LED generic
J9 J10 = CON_004pin_2x2
R2-R5 R15 R16 R18-R20 R26 R31-R33 = DISCRETE_R: 200 0402
R14 R17 = DISCRETE_R: Resistor generic
T1 T2 T7 = TEST_PT: Test point
T8-T11 = TEST_PT
U1 U2 U5 = MCP1726: 1A, Low-Voltage, Low Quiescent Current LDO Regulator
U14 = IC_LM234: 3-Terminal Adjustable Current Sources
UX = IC_OSCI_CHIP: EE290C Tapeout Class IC

## Sheet ground.SchDoc
size A; SheetNumber: 3; SheetTotal: 6
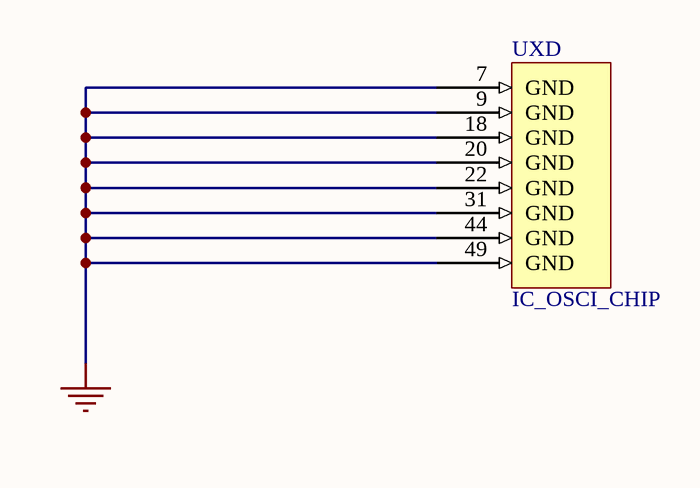
[diagram p4: ground.SchDoc]

### Parts
UX  IC_OSCI_CHIP  [QFN-48-.4-6.0X6.0-LP]  (part D of 4)

### Nets
GND: UX.7(GND) UX.9(GND) UX.18(GND) UX.20(GND) UX.22(GND) UX.31(GND) UX.44(GND) UX.49(GND)

### Library data of the parts
UX = IC_OSCI_CHIP: EE290C Tapeout Class IC

## Sheet rf_top.SchDoc
size 508 x 241 mm; SheetNumber: 5; SheetTotal: 6
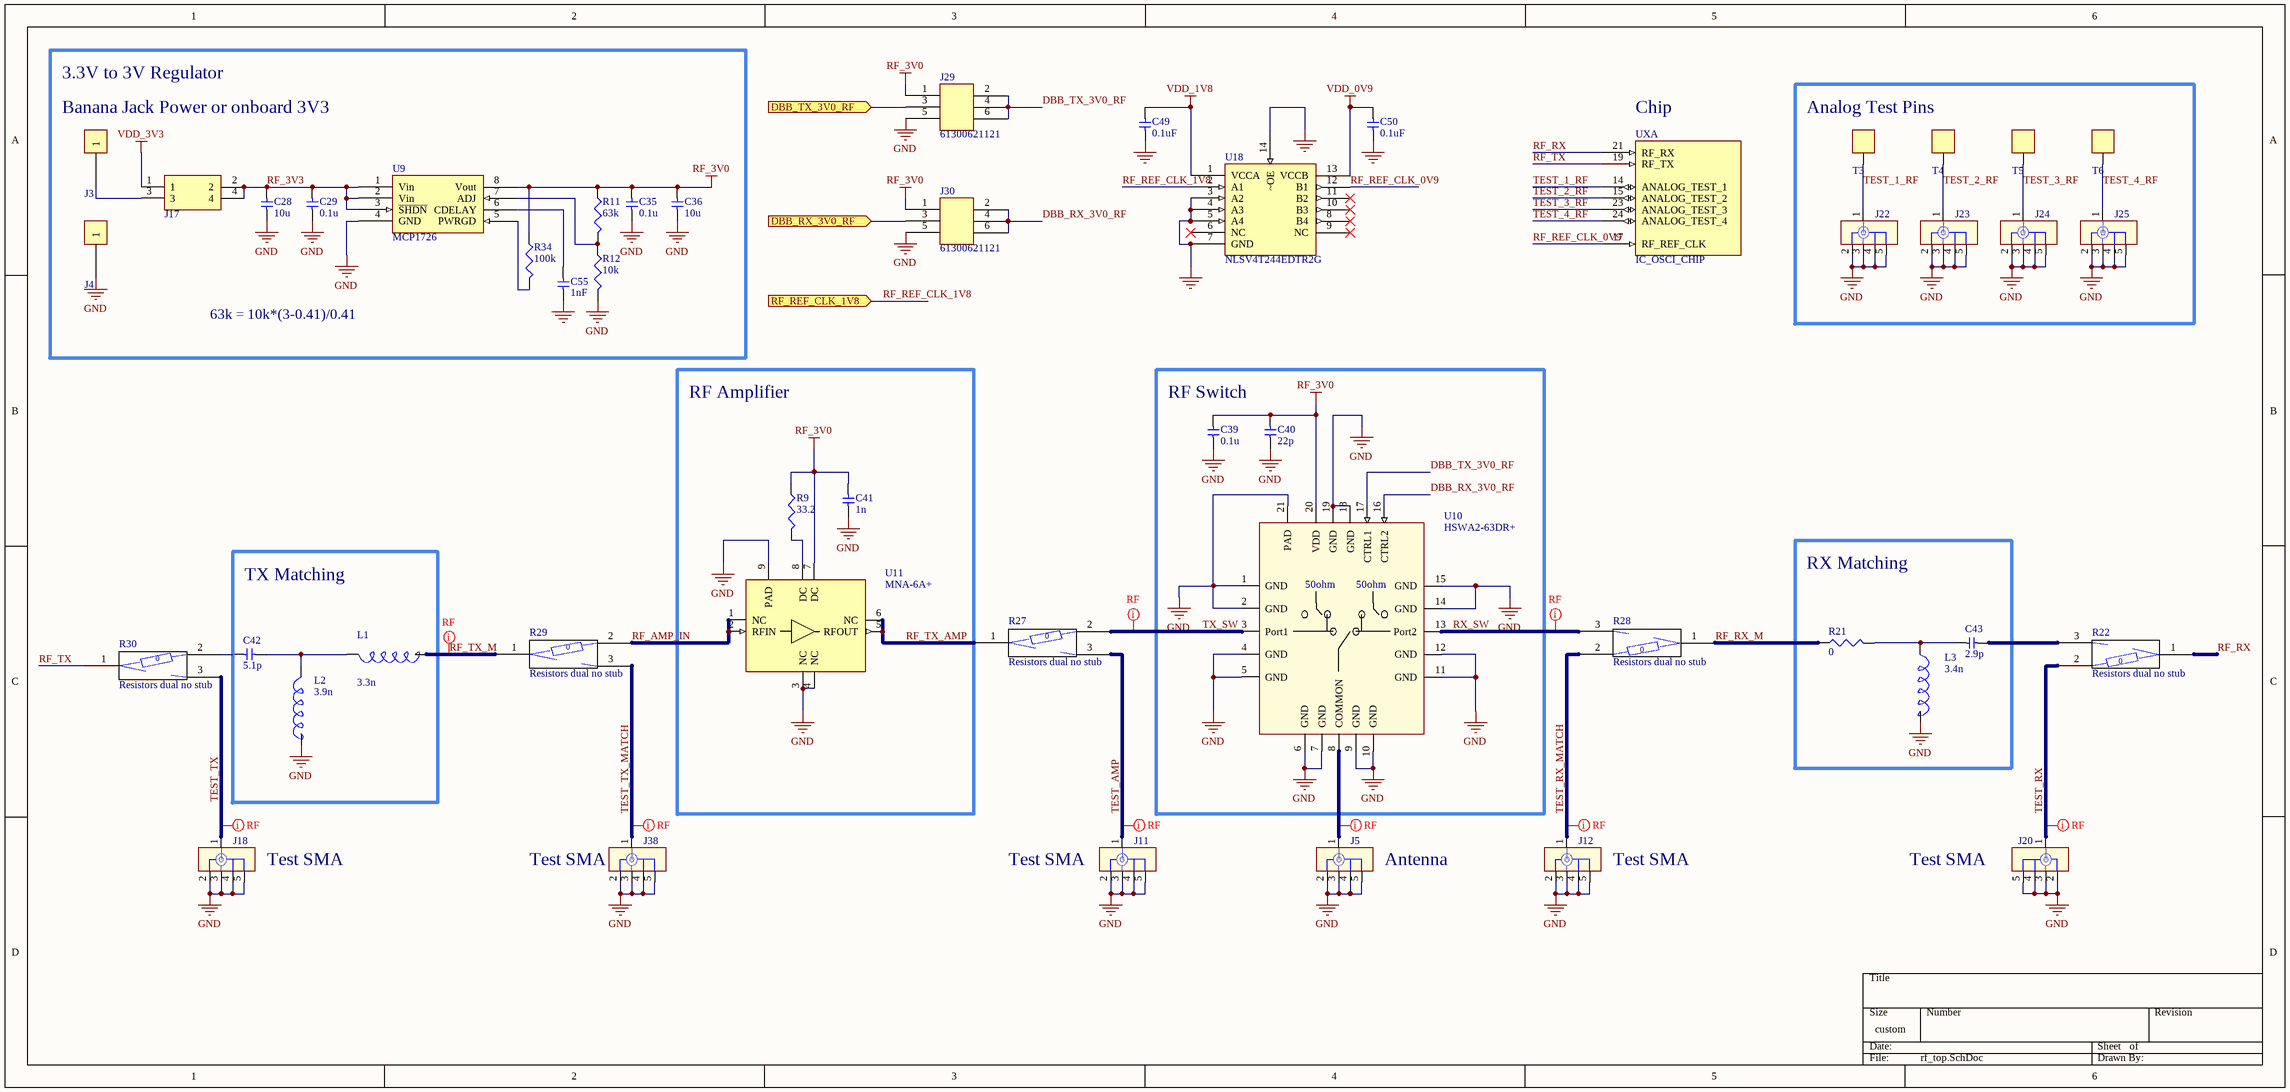
[diagram p5: rf_top.SchDoc]

### Parts
C28  10u  [0603]
C29  0.1u  [0603]
C35  0.1u  [0603]
C36  10u  [0603]
C39  0.1u  [0603]
C40  22p  [0603]
C41  1n  [0603]
C42  5.1p  [0603]
C43  2.9p  [0603]
C49  0.1uF  [0603]
C50  0.1uF  [0603]
C55  1nF  [0603]
J3  Con 1 pin  [CON-001-312X312/BANANA-JACK]  (value not drawn)
J4  Con 1 pin  [CON-001-312X312/BANANA-JACK]  (value not drawn)
J5  Con RF SMA  [CON-001-7.0X7.0/ALL-THT-SMA-ST]  (value not drawn)
J11  Con RF SMA  [CON-001-7.0X7.0/ALL-THT-SMA-ST]  (value not drawn)
J12  Con RF SMA  [CON-001-7.0X7.0/ALL-THT-SMA-ST]  (value not drawn)
J17  Con 4 pins 2x2  [CON-004-100-200X200/2X2-POST]  (value not drawn)
J18  Con RF SMA  [CON-001-7.0X7.0/ALL-THT-SMA-ST]  (value not drawn)
J20  Con RF SMA  [CON-001-7.0X7.0/ALL-THT-SMA-ST]  (value not drawn)
J22  Con RF SMA  [CON-001-7.0X7.0/ALL-THT-SMA-ST]  (value not drawn)
J23  Con RF SMA  [CON-001-7.0X7.0/ALL-THT-SMA-ST]  (value not drawn)
J24  Con RF SMA  [CON-001-7.0X7.0/ALL-THT-SMA-ST]  (value not drawn)
J25  Con RF SMA  [CON-001-7.0X7.0/ALL-THT-SMA-ST]  (value not drawn)
J29  61300621121  [CON-006-100-300X200/2X3-POST]
J30  61300621121  [CON-006-100-300X200/2X3-POST]
J38  Con RF SMA  [CON-001-7.0X7.0/ALL-THT-SMA-ST]  (value not drawn)
L1  3.3n  [0603]
L2  3.9n  [0603]
L3  3.4n  [0603]
R9  33.2  [0603]
R11  63k  [0603]
R12  10k  [0603]
R21  0  [0603]
R22  Resistors dual no stub  [1206-DUAL-NOSTUB-FLIP2]  (no BOM)
R27  Resistors dual no stub  [1206-DUAL-NOSTUB-FLIP]  (no BOM)
R28  Resistors dual no stub  [1206-DUAL-NOSTUB-FLIP2]  (no BOM)
R29  Resistors dual no stub  [1206-DUAL-NOSTUB-FLIP]  (no BOM)
R30  Resistors dual no stub  [1206-DUAL-NOSTUB-FLIP]  (no BOM)
R34  100k  [0603]
T3  Test point 1 pin  [TP-100X100/ROUND-THT]  (value not drawn)
T4  Test point 1 pin  [TP-100X100/ROUND-THT]  (value not drawn)
T5  Test point 1 pin  [TP-100X100/ROUND-THT]  (value not drawn)
T6  Test point 1 pin  [TP-100X100/ROUND-THT]  (value not drawn)
U9  MCP1726  [SOIC-8]
U10  HSWA2-63DR+  [QFN-20-.5-4.0X4.0]
U11  MNA-6A+  [QFN-08-.65-3.0X3.0]
U18  NLSV4T244EDTR2G  [TSSOP-14]
UX  IC_OSCI_CHIP  [QFN-48-.4-6.0X6.0-LP]  (part A of 4)

### Blocks framed on the sheet
Analog Test Pins: J22-J25 T3-T6
RF Amplifier: C41 R9 U11
RF Switch: C39 C40 U10
TX Matching: C42 L1 L2
RX Matching: C43 L3 R21

### Ports
DBB_RX_3V0_RF (in), DBB_TX_3V0_RF (in), RF_REF_CLK_1V8 (in)

### Nets
GND: C28.2 C29.2 C35.2 C36.2 C39.2 C40.2 C41.2 C49.2 C50.2 C55.2 J4.1 J5.2 J5.3 J5.4 J5.5 J11.2 J11.3 J11.4 J11.5 J12.2 J12.3 J12.4 J12.5 J18.2 J18.3 J18.4 J18.5 J20.2 J20.3 J20.4 J20.5 J22.2 J22.3 J22.4 J22.5 J23.2 J23.3 J23.4 J23.5 J24.2 J24.3 J24.4 J24.5 J25.2 J25.3 J25.4 J25.5 J29.5 J30.5 J38.2 J38.3 J38.4 J38.5 L2.1 L3.1 R12.2 U9.4(GND) U10.1(GND) U10.2(GND) U10.4(GND) U10.5(GND) U10.6(GND) U10.7(GND) U10.9(GND) U10.10(GND) U10.11(GND) U10.12(GND) U10.14(GND) U10.15(GND) U10.18(GND) U10.19(GND) U10.21(PAD) U11.3(NC) U11.4(NC) U11.9(PAD) U18.3(A2) U18.4(A3) U18.5(A4) U18.7(GND) U18.14(~OE)
RF_3V0: C35.1 C36.1 C39.1 C40.1 C41.1 J29.1 J30.1 R9.1 R11.1 R34.1 U9.8(Vout) U10.20(VDD) U11.7(DC)
VDD_0V9: C50.1 U18.13(VCCB)
VDD_1V8: C49.1 U18.1(VCCA)
VDD_3V3: J17.1
DBB_RX_3V0: J30.3 ; port DBB_RX_3V0_RF
DBB_RX_3V0_RF: J30.2 J30.4 J30.6 U10.16(CTRL2)
DBB_TX_3V0: J29.3 ; port DBB_TX_3V0_RF
DBB_TX_3V0_RF: J29.2 J29.4 J29.6 U10.17(CTRL1)
RF_3V3: C28.1 C29.1 J17.2 J17.4 U9.1(Vin) U9.2(Vin) U9.3(~{SHDN})
RF_AMP_IN: R29.2 U11.1(NC) U11.2(RFIN)
RF_REF_CLK_0V9: U18.12(B1) UX.17(RF_REF_CLK)
RF_REF_CLK_1V8: U18.2(A1) ; port RF_REF_CLK_1V8
RF_RX: R22.1 UX.21(RF_RX)
RF_RX_M: R21.2 R28.1
RF_TX: R30.1 UX.19(RF_TX)
RF_TX_AMP: R27.1 U11.5(RFOUT) U11.6(NC)
RF_TX_M: L1.1 R29.1
RX_SW: R28.3 U10.13(Port2)
TEST_1_RF: J22.1 T3.1 UX.14(ANALOG_TEST_1)
TEST_2_RF: J23.1 T4.1 UX.15(ANALOG_TEST_2)
TEST_3_RF: J24.1 T5.1 UX.23(ANALOG_TEST_3)
TEST_4_RF: J25.1 T6.1 UX.24(ANALOG_TEST_4)
TEST_AMP: J11.1 R27.3
TEST_RX: J20.1 R22.2
TEST_RX_MATCH: J12.1 R28.2
TEST_TX: J18.1 R30.3
TEST_TX_MATCH: J38.1 R29.3
TX_SW: R27.2 U10.3(Port1)
NetC42_1: C42.1 R30.2
NetC42_2: C42.2 L1.2 L2.2
NetC43_1: C43.1 R22.3
NetC43_2: C43.2 L3.2 R21.1
NetC55_1: C55.1 U9.6(CDELAY)
NetJ3_1: J3.1 J17.3
NetJ5_1: J5.1 U10.8(COMMON)
NetR9_2: R9.2 U11.8(DC)
NetR11_2: R11.2 R12.1 U9.7(ADJ)
NetR34_2: R34.2 U9.5(PWRGD)

Not connected (* = marked no-connect by the designer): U18 6(NC)* 8(B4)* 9(NC)* 10(B3)* 11(B2)*

### Layout directives
net class RF: NetJ5_1, RF_TX_M, RX_SW, TEST_AMP, TEST_RX, TEST_RX_MATCH, TEST_TX, TEST_TX_MATCH, TX_SW

### Notes on the sheet
- 3.3V to 3V Regulator
- (near J3) Banana Jack Power or onboard 3V3
- (near UX) Chip
- 63k = 10k*(3-0.41)/0.41
- (near J18) Test SMA
- (near J38) Test SMA
- (near J11) Test SMA
- (near J5) Antenna
- (near J12) Test SMA
- (near J20) Test SMA
- (in symbol DISCRETE_R_DUAL) 0
- (in symbol IC_HSWA2-63DR+) 50ohm

### Library data of the parts
C28 C29 C35 C36 C39-C43 = DISCRETE_C: Capacitor generic
C49 C50 C55 = DISCRETE_C: 0.1uF 0402
J3 J4 = CON_001pin_1x1
J5 J11 J12 J18 J20 J22-J25 J38 = CON_RF_SMA
J17 = CON_004pin_2x2
L1-L3 = DISCRETE_L: Inductor generic
R9 R11 R12 R21 = DISCRETE_R: Resistor generic
R22 R27-R30 = DISCRETE_R_DUAL
R34 = DISCRETE_R: 200 0402
T3-T6 = TEST_PT
U9 = MCP1726: as U1 on sheet power
U10 = IC_HSWA2-63DR+: HSWA2-63DR+ RF T/R switch
U11 = IC_MNA-6A+: MNA-6A+ RF power amplifier
U18 = NLSV4T244EDTR2G: as U3 on sheet digital_top
UX = IC_OSCI_CHIP: EE290C Tapeout Class IC

## Sheet clocking.SchDoc
size A; SheetNumber: 6; SheetTotal: 6
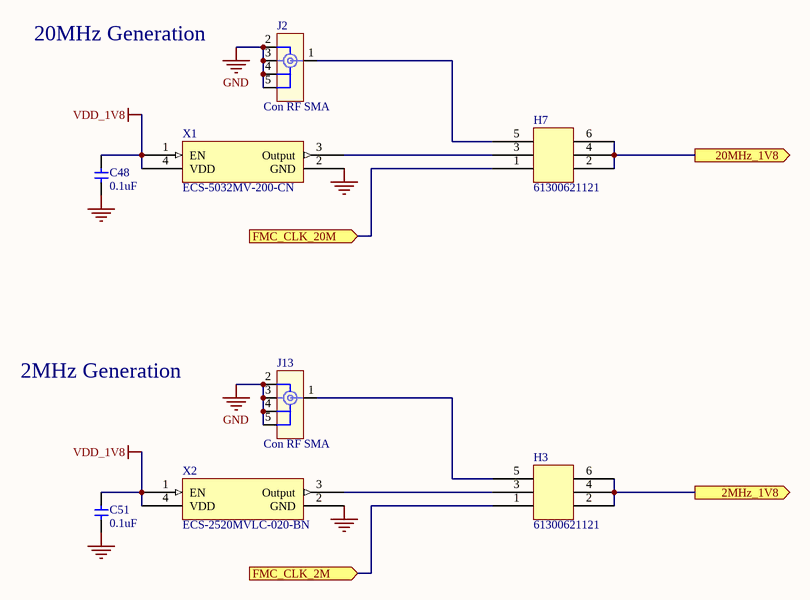
[diagram p6: clocking.SchDoc]

### Parts
C48  0.1uF  [0603]
C51  0.1uF  [0603]
H3  61300621121  [CON-006-100-300X200/2X3-POST]
H7  61300621121  [CON-006-100-300X200/2X3-POST]
J2  Con RF SMA  [CON-001-7.0X7.0/ALL-THT-SMA-ST]
J13  Con RF SMA  [CON-001-7.0X7.0/ALL-THT-SMA-ST]
X1  ECS-5032MV-200-CN  [XTAL-04-5.0X3.2]
X2  ECS-2520MVLC-020-BN  [XTAL-04-2.5X2.0]

### Ports
2MHz_1V8 (out), 20MHz_1V8 (out), FMC_CLK_2M (in), FMC_CLK_20M (in)

### Nets
GND: C48.2 C51.2 J2.2 J2.3 J2.4 J2.5 J13.2 J13.3 J13.4 J13.5 X1.2(GND) X2.2(GND)
VDD_1V8: C48.1 C51.1 X1.1(EN) X1.4(VDD) X2.1(EN) X2.4(VDD)
20MHz_1V8: H7.2 H7.4 H7.6 ; port 20MHz_1V8
FMC_ADC_CLK_TOP: H3.1 ; port FMC_CLK_2M
FMC_CLK_TOP: H7.1 ; port FMC_CLK_20M
RF_REF_CLK_1V8: H3.2 H3.4 H3.6 ; port 2MHz_1V8
NetH3_3: H3.3 X2.3(Output)
NetH3_5: H3.5 J13.1
NetH7_3: H7.3 X1.3(Output)
NetH7_5: H7.5 J2.1

### Notes on the sheet
- 20MHz Generation
- 2MHz Generation

### Library data of the parts
C48 C51 = DISCRETE_C: 0.1uF 0402
J2 J13 = CON_RF_SMA
X1 = ECS-5032MV-200-CN: 20 MHz HCMOS Oscillator, 1.6 - 3.6V
X2 = ECS-2520MVLC-020-BN: 2MHz CMOS Oscillator, 1.6 - 3.6V

## Nets that join several sheets
FMC_1V8: digital_top (6 pins), power (J10.3)
FMC_3V3: digital_top (6 pins), power (J9.3)
GND: digital_top (219 pins), power (43 pins), ground (8 pins), rf_top (80 pins), clocking (12 pins)
RF_3V0: digital_top (C31.1 U12.13), rf_top (13 pins)
VDD_0V9: power (8 pins), rf_top (C50.1 U18.13)
VDD_1V8: digital_top (16 pins), power (5 pins), rf_top (C49.1 U18.1), clocking (6 pins)
VDD_3V3: digital_top (22 pins), power (18 pins), rf_top (J17.1)
20MHz_1V8: digital_top (U15.3 UX.3), clocking (H7.2 H7.4 H7.6)
DBB_RX_3V0: digital_top (U12.11), rf_top (J30.3)
DBB_TX_3V0: digital_top (U12.12), rf_top (J29.3)
FMC_ADC_CLK_TOP: digital_top (J1.e3), clocking (H3.1)
FMC_CLK_TOP: digital_top (J1.h7), clocking (H7.1)
RF_REF_CLK_1V8: rf_top (U18.2), clocking (H3.2 H3.4 H3.6)